# Altium schematic sheet Power.SchDoc
size A4
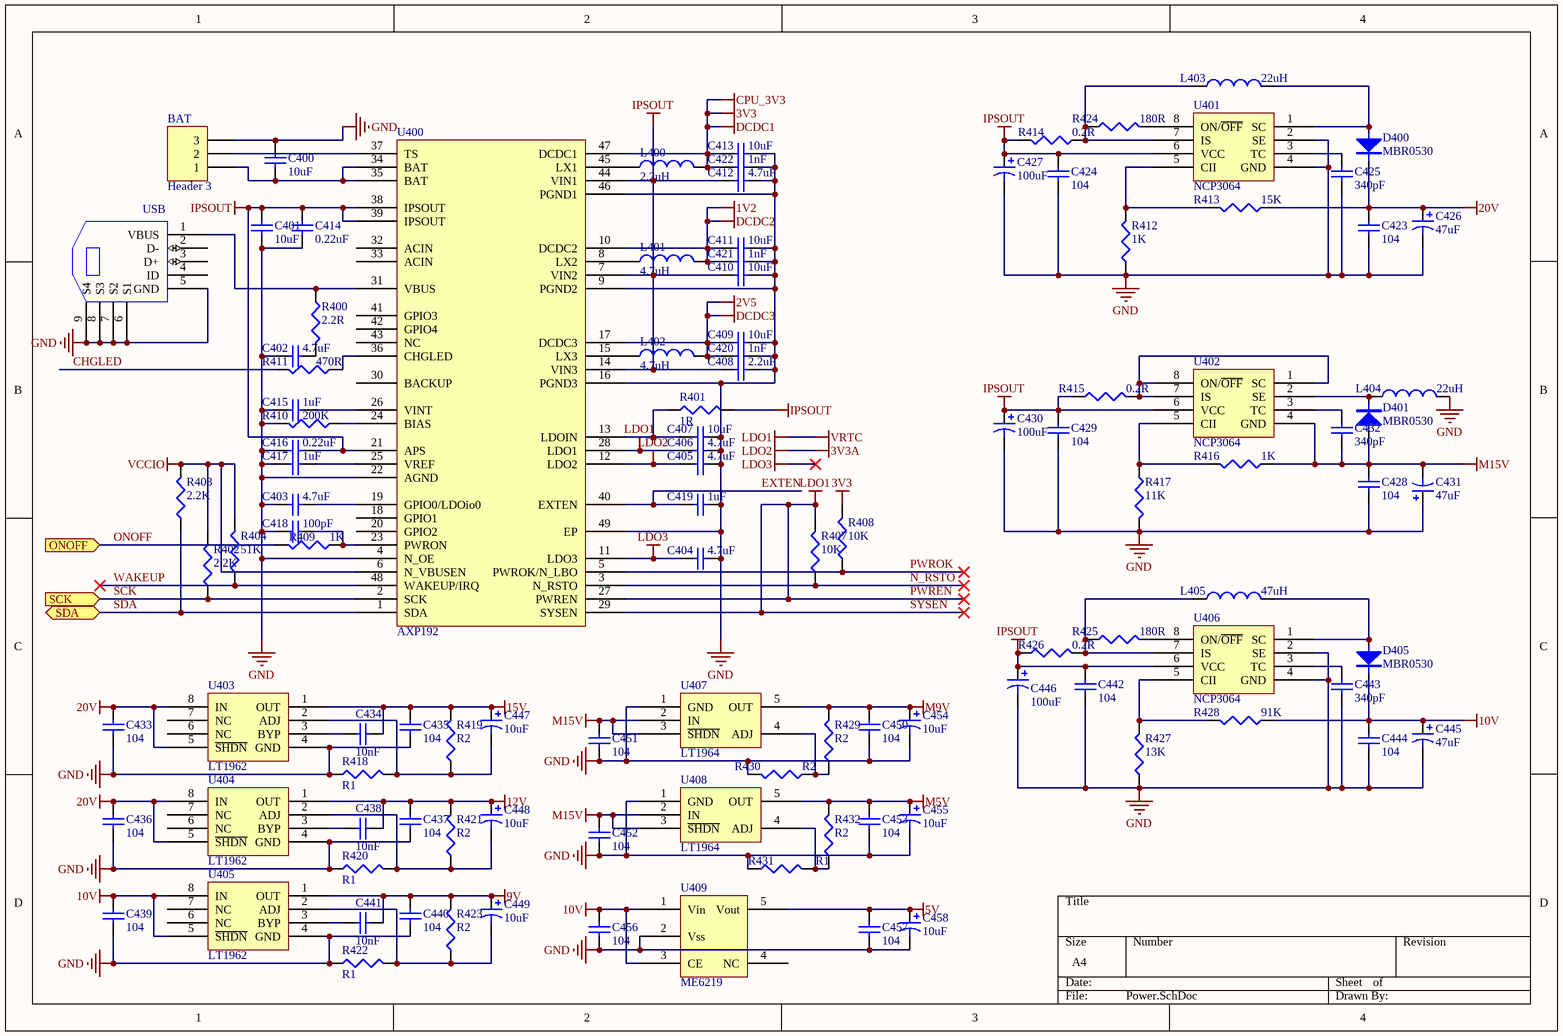
[diagram p0: Power.SchDoc]

## Parts
BAT  Header 3  [LBAT]
C400  10uF  [C0805]
C401  10uF  [C0805]
C402  4.7uF  [C0805]
C403  4.7uF  [C0805]
C404  4.7uF  [C0805]
C405  4.7uF  [C0805]
C406  4.7uF  [C0805]
C407  10uF  [C0805]
C408  2.2uF  [C0805]
C409  10uF  [C0805]
C410  10uF  [C0805]
C411  10uF  [C0805]
C412  4.7uF  [C0805]
C413  10uF  [C0805]
C414  0.22uF  [C0603]
C415  1uF  [C0603]
C416  0.22uF  [C0603]
C417  1uF  [C0603]
C418  100pF  [C0603]
C419  1uF  [C0603]
C420  1nF  [C0603]
C421  1nF  [C0603]
C422  1nF  [C0603]
C423  104  [C0402]
C424  104  [C0402]
C425  340pF  [C0402]
C426  47uF  [7343]
C427  100uF  [C0805]
C428  104  [C0402]
C429  104  [C0402]
C430  100uF  [C0805]
C431  47uF  [7343]
C432  340pF  [C0805]
C433  104  [C0402]
C434  10nF  [C0402]
C435  104  [C0402]
C436  104  [C0402]
C437  104  [C0402]
C438  10nF  [C0402]
C439  104  [C0402]
C440  104  [C0402]
C441  10nF  [C0402]
C442  104  [C0402]
C443  340pF  [C0402]
C444  104  [C0402]
C445  47uF  [7343]
C446  100uF  [C0805]
C447  10uF  [7343]
C448  10uF  [7343]
C449  10uF  [7343]
C450  104  [C0402]
C451  104  [C0402]
C452  104  [C0402]
C453  104  [C0402]
C454  10uF  [7343]
C455  10uF  [7343]
C456  104  [C0402]
C457  104  [C0402]
C458  10uF  [7343]
D400  MBR0530  [SOD123]
D401  MBR0530  [SOD123]
D405  MBR0530  [SOD123]
L400  2.2uH  [IND_4X4]
L401  4.7uH  [IND_4X4]
L402  4.7uH  [IND_4X4]
L403  22uH  [IND_4X4]
L404  22uH  [IND_4X4]
L405  47uH  [IND_4X4]
R400  2.2R  [R0603]
R401  1R  [R0805]
R402  2.2K  [R0603]
R403  2.2K  [R0603]
R404  51K  [R0603]
R407  10K  [R0603]
R408  10K  [R0603]
R409  1K  [R0603]
R410  200K  [R0603]
R411  470R  [R0603]
R412  1K  [R0603]
R413  15K  [R0603]
R414  0.2R  [R0805]
R415  0.2R  [R0805]
R416  1K  [R0603]
R417  11K  [R0603]
R418  R1  [R0603]
R419  R2  [R0603]
R420  R1  [R0603]
R421  R2  [R0603]
R422  R1  [R0603]
R423  R2  [R0603]
R424  180R  [R0603]
R425  180R  [R0603]
R426  0.2R  [R0805]
R427  13K  [R0603]
R428  91K  [R0603]
R429  R2  [R0603]
R430  R2  [R0603]
R431  R1  [R0603]
R432  R2  [R0603]
U400  AXP192  [QFN-48]
U401  NCP3064  [SOP-8]
U402  NCP3064  [SOP-8]
U403  LT1962  [MS8]
U404  LT1962  [MS8]
U405  LT1962  [MS8]
U406  NCP3064  [SOP-8]
U407  LT1964  [SOT25]
U408  LT1964  [SOT25]
U409  ME6219  [SOT25]
USB  USB-MICRO  [HUM011D-5-S]  (value not drawn)

## Ports
ONOFF (in), SCK (in), SDA (bidir)

## Nets
1V2: C411.1 C421.2 L401.2 U400.10(DCDC2)  [also labelled DCDC2]
2V5: C409.1 C420.2 L402.2 U400.17(DCDC3)  [also labelled DCDC3]
3V3: C413.1 C422.2 L400.2 R408.2 U400.47(DCDC1)  [also labelled CPU_3V3, DCDC1]
3V3A: C405.1 U400.12(LDO2)  [also labelled LDO2]
5V: C457.2 C458.1 U409.5(Vout)
9V: C440.2 C441.1 C449.1 R423.2 U405.1(OUT)
10V: C439.2 C444.1 C445.1 C456.2 D405.2 R428.1 U405.5(~{SHDN}) U405.8(IN) U409.1(Vin) U409.3(CE)
12V: C437.1 C438.2 C448.1 R421.2 U404.1(OUT)
15V: C434.1 C435.1 C447.1 R419.2 U403.1(OUT)
20V: C423.2 C426.1 C433.2 C436.1 D400.2 R413.1 U403.5(~{SHDN}) U403.8(IN) U404.5(~{SHDN}) U404.8(IN)
GND: BAT.3 C400.2 C401.1 C402.2 C403.1 C404.1 C405.2 C406.2 C407.2 C408.2 C409.2 C410.2 C411.2 C412.2 C413.2 C414.1 C415.2 C416.2 C417.2 C418.2 C419.1 C420.1 C421.1 C422.1 C423.1 C424.1 C425.1 C426.2 C427.2 C428.1 C429.1 C430.2 C431.1 C433.1 C435.2 C436.2 C437.2 C439.1 C440.1 C442.2 C443.2 C444.2 C445.2 C446.2 C450.1 C451.1 C452.1 C453.1 C454.2 C455.2 C456.1 C457.1 C458.2 L404.2 R410.2 R412.1 R417.2 R418.1 R420.1 R422.1 R427.1 R430.2 R431.1 U400.4(N_OE) U400.9(PGND2) U400.16(PGND3) U400.22(AGND) U400.46(PGND1) U400.49(EP) U401.2(SE) U401.4(GND) U403.4(GND) U404.4(GND) U405.4(GND) U406.2(SE) U406.4(GND) U407.1(GND) U408.1(GND) U409.2(Vss) USB.5(GND) USB.6(S1) USB.7(S2) USB.8(S3) USB.9(S4)
IPSOUT: C401.2 C408.1 C410.1 C412.1 C414.2 C416.1 C424.2 C427.1 C429.2 C430.1 C442.1 C446.1 R401.2 R414.2 R415.1 R426.1 U400.7(VIN2) U400.14(VIN3) U400.21(APS) U400.38(IPSOUT) U400.39(IPSOUT) U400.44(VIN1) U401.6(VCC) U402.6(VCC) U406.6(VCC)
LDO3: C404.2 U400.11(LDO3)
M5V: C453.2 C455.1 R432.2 U408.5(OUT)
M9V: C450.2 C454.1 R429.2 U407.5(OUT)
M15V: C428.2 C431.2 C432.1 C451.2 C452.2 D401.1 R416.1 U402.4(GND) U407.2(IN) U407.3(~{SHDN}) U408.2(IN) U408.3(~{SHDN})
PWREN: C406.1 R407.2 U400.27(PWREN) U400.28(LDO1) U400.29(SYSEN)  [also labelled LDO1, SYSEN, VRTC]
VCCIO: R402.2 R403.2 R404.2 U400.6(N_VBUSEN)
CHGLED: R411.2
EXTEN: C419.2 U400.40(EXTEN)
N_RSTO: R407.1 U400.3(N_RSTO)
ONOFF: R409.2 ; port ONOFF
PWROK: R408.1 U400.5(PWROK/N_LBO)
SCK: R402.1 U400.2(SCK) ; port SCK
SDA: R403.1 U400.1(SDA) ; port SDA
WAKEUP: R404.1 U400.48(WAKEUP/IRQ)
NetBAT_1: BAT.1 C400.1 U400.34(BAT) U400.35(BAT)
NetBAT_2: BAT.2 U400.37(TS)
NetC402_1: C402.1 R400.2
NetC403_2: C403.2 U400.19(GPIO0/LDOio0)
NetC407_1: C407.1 R401.1 U400.13(LDOIN)
NetC415_1: C415.1 U400.26(VINT)
NetC417_1: C417.1 U400.25(VREF)
NetC418_1: C418.1 R409.1 U400.23(PWRON)
NetC425_2: C425.2 U401.3(TC)
NetC432_2: C432.2 U402.3(TC)
NetC434_2: C434.2 U403.3(BYP)
NetC438_1: C438.1 U404.3(BYP)
NetC441_2: C441.2 U405.3(BYP)
NetC443_1: C443.1 U406.3(TC)
NetC447_2: C447.2 R418.2 R419.1 U403.2(ADJ)
NetC448_2: C448.2 R420.2 R421.1 U404.2(ADJ)
NetC449_2: C449.2 R422.2 R423.1 U405.2(ADJ)
NetD400_1: D400.1 L403.2 U401.1(SC)
NetD401_2: D401.2 L404.1 U402.2(SE)
NetD405_1: D405.1 L405.2 U406.1(SC)
NetL400_1: L400.1 U400.45(LX1)
NetL401_1: L401.1 U400.8(LX2)
NetL402_1: L402.1 U400.15(LX3)
NetL403_1: L403.1 R414.1 R424.1 U401.7(IS)
NetL405_1: L405.1 R425.1 R426.2 U406.7(IS)
NetR400_1: R400.1 U400.31(VBUS) USB.1(VBUS)
NetR410_1: R410.1 U400.24(BIAS)
NetR411_1: R411.1 U400.36(CHGLED)
NetR412_2: R412.2 R413.2 U401.5(CII)
NetR415_2: R415.2 U402.1(SC) U402.7(IS) U402.8(ON/~{OFF})
NetR416_2: R416.2 R417.1 U402.5(CII)
NetR424_2: R424.2 U401.8(ON/~{OFF})
NetR425_2: R425.2 U406.8(ON/~{OFF})
NetR427_2: R427.2 R428.2 U406.5(CII)
NetR429_1: R429.1 R430.1 U407.4(ADJ)
NetR431_2: R431.2 R432.1 U408.4(ADJ)

Not connected (* = marked no-connect by the designer): U400 18(GPIO1) 20(GPIO2) 30(BACKUP) 32(ACIN) 33(ACIN) 41(GPIO3) 42(GPIO4) 43(NC); U403 6(NC) 7(NC); U404 6(NC) 7(NC); U405 6(NC) 7(NC); U409 4(NC); USB 2(D-) 3(D+) 4(ID)

## Library data of the parts
BAT = Header 3: Header, 3-Pin; LatestRevisionDate: 17-Jul-2002; LatestRevisionNote: Re-released for DXP Platform.; Publisher: Altium Limited
C400-C417 C419-C425 C428 C429 C432-C444 C450-C453 C456 C457 = Cap Semi: Capacitor (Semiconductor SIM Model); Value: 100pF; Published: 8-Jun-2000; LatestRevisionDate: 29-May-2009; LatestRevisionNote: IPC-7351 Footprint Added.; PackageReference: C1206; Publisher: Altium Limited; PackageDescription: Chip Capacitor
C418 = Cap Semi: Capacitor (Semiconductor SIM Model); Published: 8-Jun-2000; LatestRevisionDate: 29-May-2009; LatestRevisionNote: IPC-7351 Footprint Added.; PackageReference: C1206; Publisher: Altium Limited; PackageDescription: Chip Capacitor; Value: 100pF
C426 C427 C430 C431 C445-C449 C454 C455 C458 = Cap Pol1: Polarized Capacitor (Radial); Value: 100pF; Published: 8-Jun-2000; LatestRevisionDate: 17-Jul-2002; LatestRevisionNote: Re-released for DXP Platform.; PackageReference: RB7.6-15; Publisher: Altium Limited; PackageDescription: Polarized Capacitor (Radial); 2 Leads
L400-L405 = Inductor: Code_IEC: 1005; Value: 10mH; Published: 8-Jun-2000; LatestRevisionDate: 29-May-2009; LatestRevisionNote: IPC-7351 Footprint Added.; PackageReference: 0402-A; Publisher: Altium Limited; PackageDescription: Chip Inductor; Code_JEITA: 0402
R400-R404 R407 R408 R410 R411 R413-R415 R417-R432 = Res3: Resistor; Value: 1K; Published: 8-Jun-2000; LatestRevisionDate: 29-May-2009; LatestRevisionNote: IPC-7351 Footprint Added.; PackageReference: J1-0603; Publisher: Altium Limited; PackageDescription: Chip Resistor
R409 R412 R416 = Res3: Resistor; Published: 8-Jun-2000; LatestRevisionDate: 29-May-2009; LatestRevisionNote: IPC-7351 Footprint Added.; PackageReference: J1-0603; Publisher: Altium Limited; PackageDescription: Chip Resistor; Value: 1K
USB = USB-MICRO: PCB DECAL: HIROSE-US60B-MB-5ST; Source_Path: Z:\ORCAD\CONNECTOR.OLB; Value: miniAB